# EAGLE design fuzz (EAGLE 8.5.2)
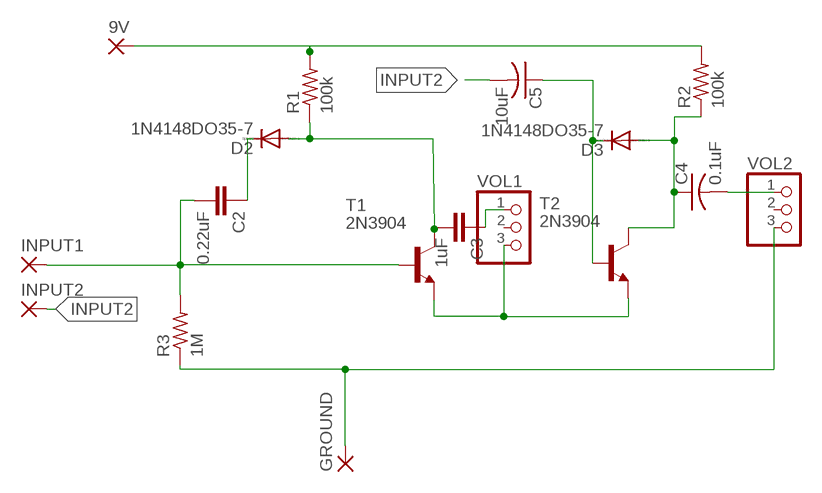
[diagram p0: schematic, sheet 1]

## Parts
9V  2,15/1,0  [2,15/1,0]
C2  0.22uF  C-EU025-025X050  [C025-025X050]
C3  1uF  C-EU025-025X050  [C025-025X050]
C4  0.1uF  C-US025-025X050  [C025-025X050]
C5  10uF  C-US025-025X050  [C025-025X050]
D2  1N4148DO35-7  [DO35-7]
D3  1N4148DO35-7  [DO35-7]
GROUND  2,15/1,0  [2,15/1,0]
INPUT1  2,15/1,0  [2,15/1,0]
INPUT2  2,15/1,0  [2,15/1,0]
R1  100k  R-US_0207/10  [0207/10]
R2  100k  R-US_0207/10  [0207/10]
R3  1M  R-US_0207/10  [0207/10]
T1  2N3904  [TO92]
T2  2N3904  [TO92]
VOL1  PINHD-1X3  [1X03]
VOL2  PINHD-1X3  [1X03]

## Nets
INPUT2: C5.2 INPUT2.1(P)
N$1: C3.1 VOL1.1
N$2: C2.2 INPUT1.1(P) R3.2 T1.2(B)
N$3: C3.2 D2.A R1.1 T1.1(C)
N$4: C5.1 D3.C T2.2(B)
N$5: C4.1 D3.A R2.1 T2.1(C)
N$6: 9V.1(P) R1.2 R2.2
N$8: C4.2 VOL2.1
N$9: T1.3(E) T2.3(E) VOL1.3
N$10: GROUND.1(P) R3.1 VOL2.3
N$11: C2.1 D2.C
Unconnected: VOL1.2 VOL2.2

## Library data of the parts
9V GROUND INPUT1 INPUT2 = wirepad:2,15/1,0: THROUGH-HOLE PAD
C2 C3 = resistor:C-EU: CAPACITOR, European symbol
C4 C5 = resistor:C-US: CAPACITOR, American symbol
D2 D3 = diode:1N4148: DIODE high speed (Philips)
R1-R3 = resistor:R-US_: RESISTOR, American symbol
T1 T2 = transistor:2N3904: NPN TRANSISTOR
VOL1 VOL2 = pinhead:PINHD-1X3: PIN HEADER

## Board
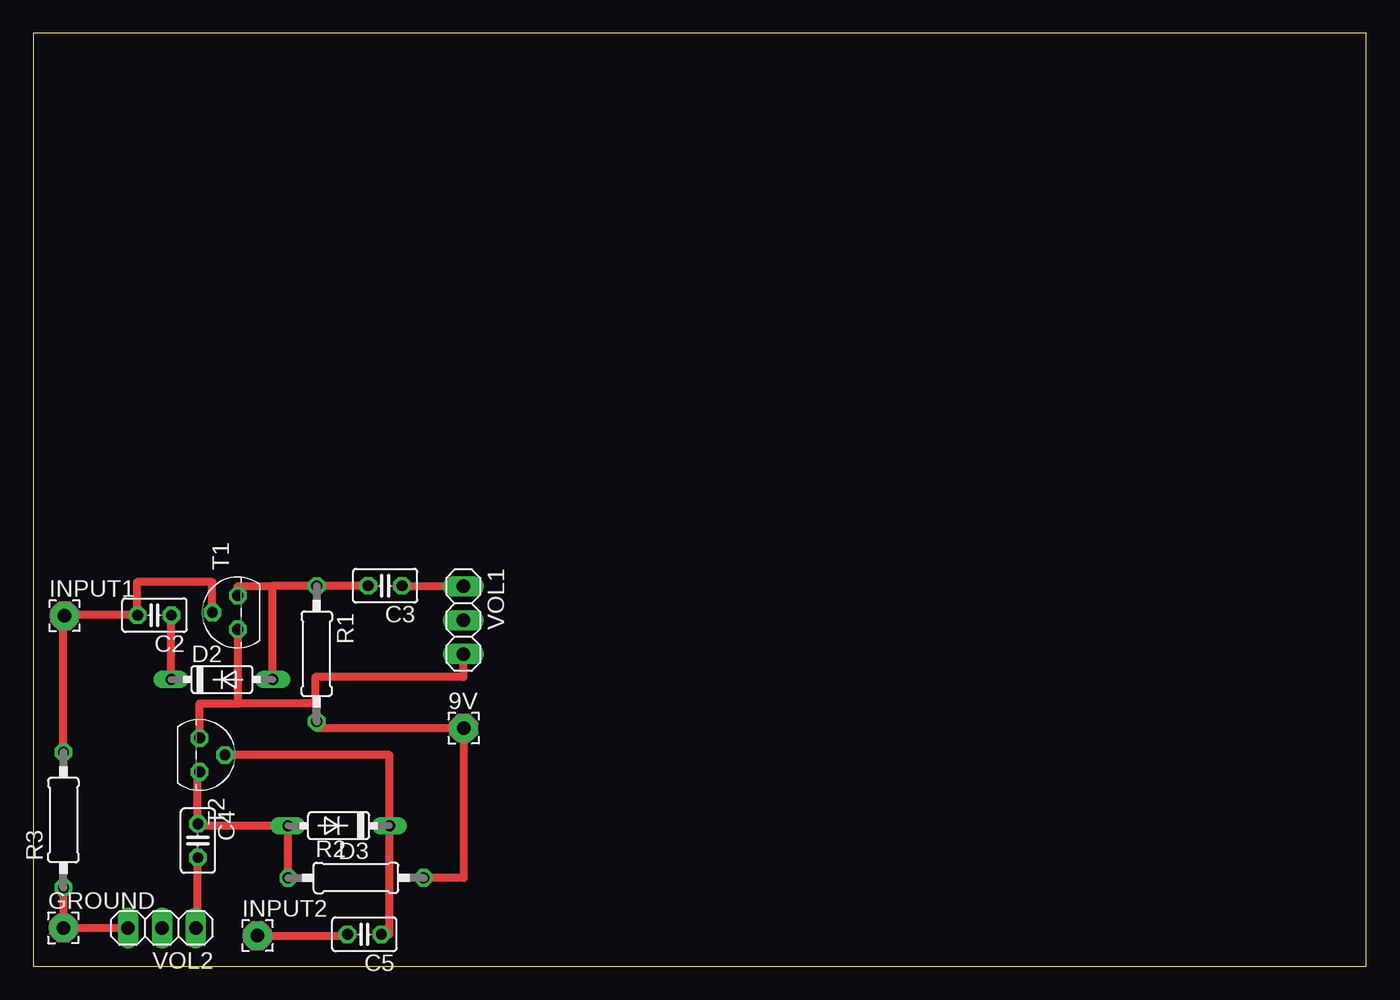
[diagram p1: board, top side]

Size 100 x 70 mm. Coordinates in mm from the lower left corner, seen from the top.
Outline: 0,0 100,0 100,70 0,70 0,0
Copper layers (1*16): Top 0.035mm / dielectric 1.5mm / Bottom 0.035mm
Design rules "default": minimum track width 6mil, minimum drill 0.35mm, track to track 6mil, track to pad 6mil, pad to pad 6mil, via to via 6mil, smd to smd 6mil, copper to edge 40mil, drill to drill 6mil, minimum pad ring 10mil, minimum via ring 8mil, stop-mask expansion 4mil, vias tented up to drill 0mil, thermal gap 10mil

### Footprints (pad centres in the part's own frame; a part is rotated, then mirrored left to right if it is on the bottom)
2,15/1,0 = drill 1.016 pad 2.159 octagon: 1 0,0
C025-025X050 = drill 0.813 octagon: 1 -1.27,0; 2 1.27,0
DO35-7 = drill 0.813 long: A 3.81,0; C -3.81,0
0207/10 = drill 0.813 octagon: 1 -5.08,0; 2 5.08,0
TO92 = drill 0.813 octagon: 1 1.27,0; 2 0,1.905; 3 -1.27,0
1X03 = drill 1.016 long: 1 -2.54,0; 2 0,0; 3 2.54,0

### Placement (x,y rotation side)
9V  32.28,17.86 0 top
C2  9.09,26.34 180 top
C3  26.39,28.55 180 top
C4  12.34,9.42 270 top
C5  24.84,2.39 180 top
D2  14.15,21.51 0 top
D3  22.91,10.54 180 top
GROUND  2.26,2.87 0 top
INPUT1  2.34,26.29 0 top
INPUT2  16.81,2.29 0 top
R1  21.26,23.44 270 top
R2  24.21,6.63 0 top
R3  2.26,10.97 90 top
T1  15.34,26.54 90 top
T2  12.47,15.85 270 top
VOL1  32.26,25.96 270 top
VOL2  9.65,2.87 180 top

### Tracks (layer width: path | path; a pad name or v marks a point on that pad's centre or on a via)
INPUT2
  Top 0.61: INPUT2.1 23.57,2.29 C5.2
N$1
  Top 0.61: VOL1.1 27.66,28.5 C3.1
N$2
  Top 0.61: T1.2 13.44,28.83 7.77,28.83 7.77,26.34 C2.2 2.34,26.34 | 2.34,26.34 INPUT1.1 | R3.2 2.26,26.34 2.34,26.34
N$3
  Top 0.61: T1.1 15.34,28.52 17.96,28.52 | D2.A 17.96,28.52 | 17.96,28.52 17.96,28.55 | C3.2 21.26,28.55 R1.1 17.96,28.52
N$4
  Top 0.61: T2.2 26.72,15.85 D3.C 26.72,2.39 C5.1
N$5
  Top 0.61: T2.1 12.34,14.58 C4.1 12.34,10.54 D3.A 19.1,6.63 R2.1
N$6
  Top 0.61: 9V.1 32.28,6.63 R2.2 | 9V.1 32.28,17.42 | 9V.1 21.26,17.86 R1.2
N$8
  Top 0.61: VOL2.1 12.34,2.87 C4.2
N$9
  Top 0.61: T1.3 15.34,19.71 | T2.3 12.47,19.71 15.34,19.71 | VOL1.3 32.26,21.69 21.16,21.69 21.16,19.71 15.34,19.71
N$10
  Top 0.61: R3.1 GROUND.1 VOL2.3
N$11
  Top 0.61: D2.C 10.34,26.34 C2.1